# EAGLE design drv_ps (EAGLE 7.2.0)
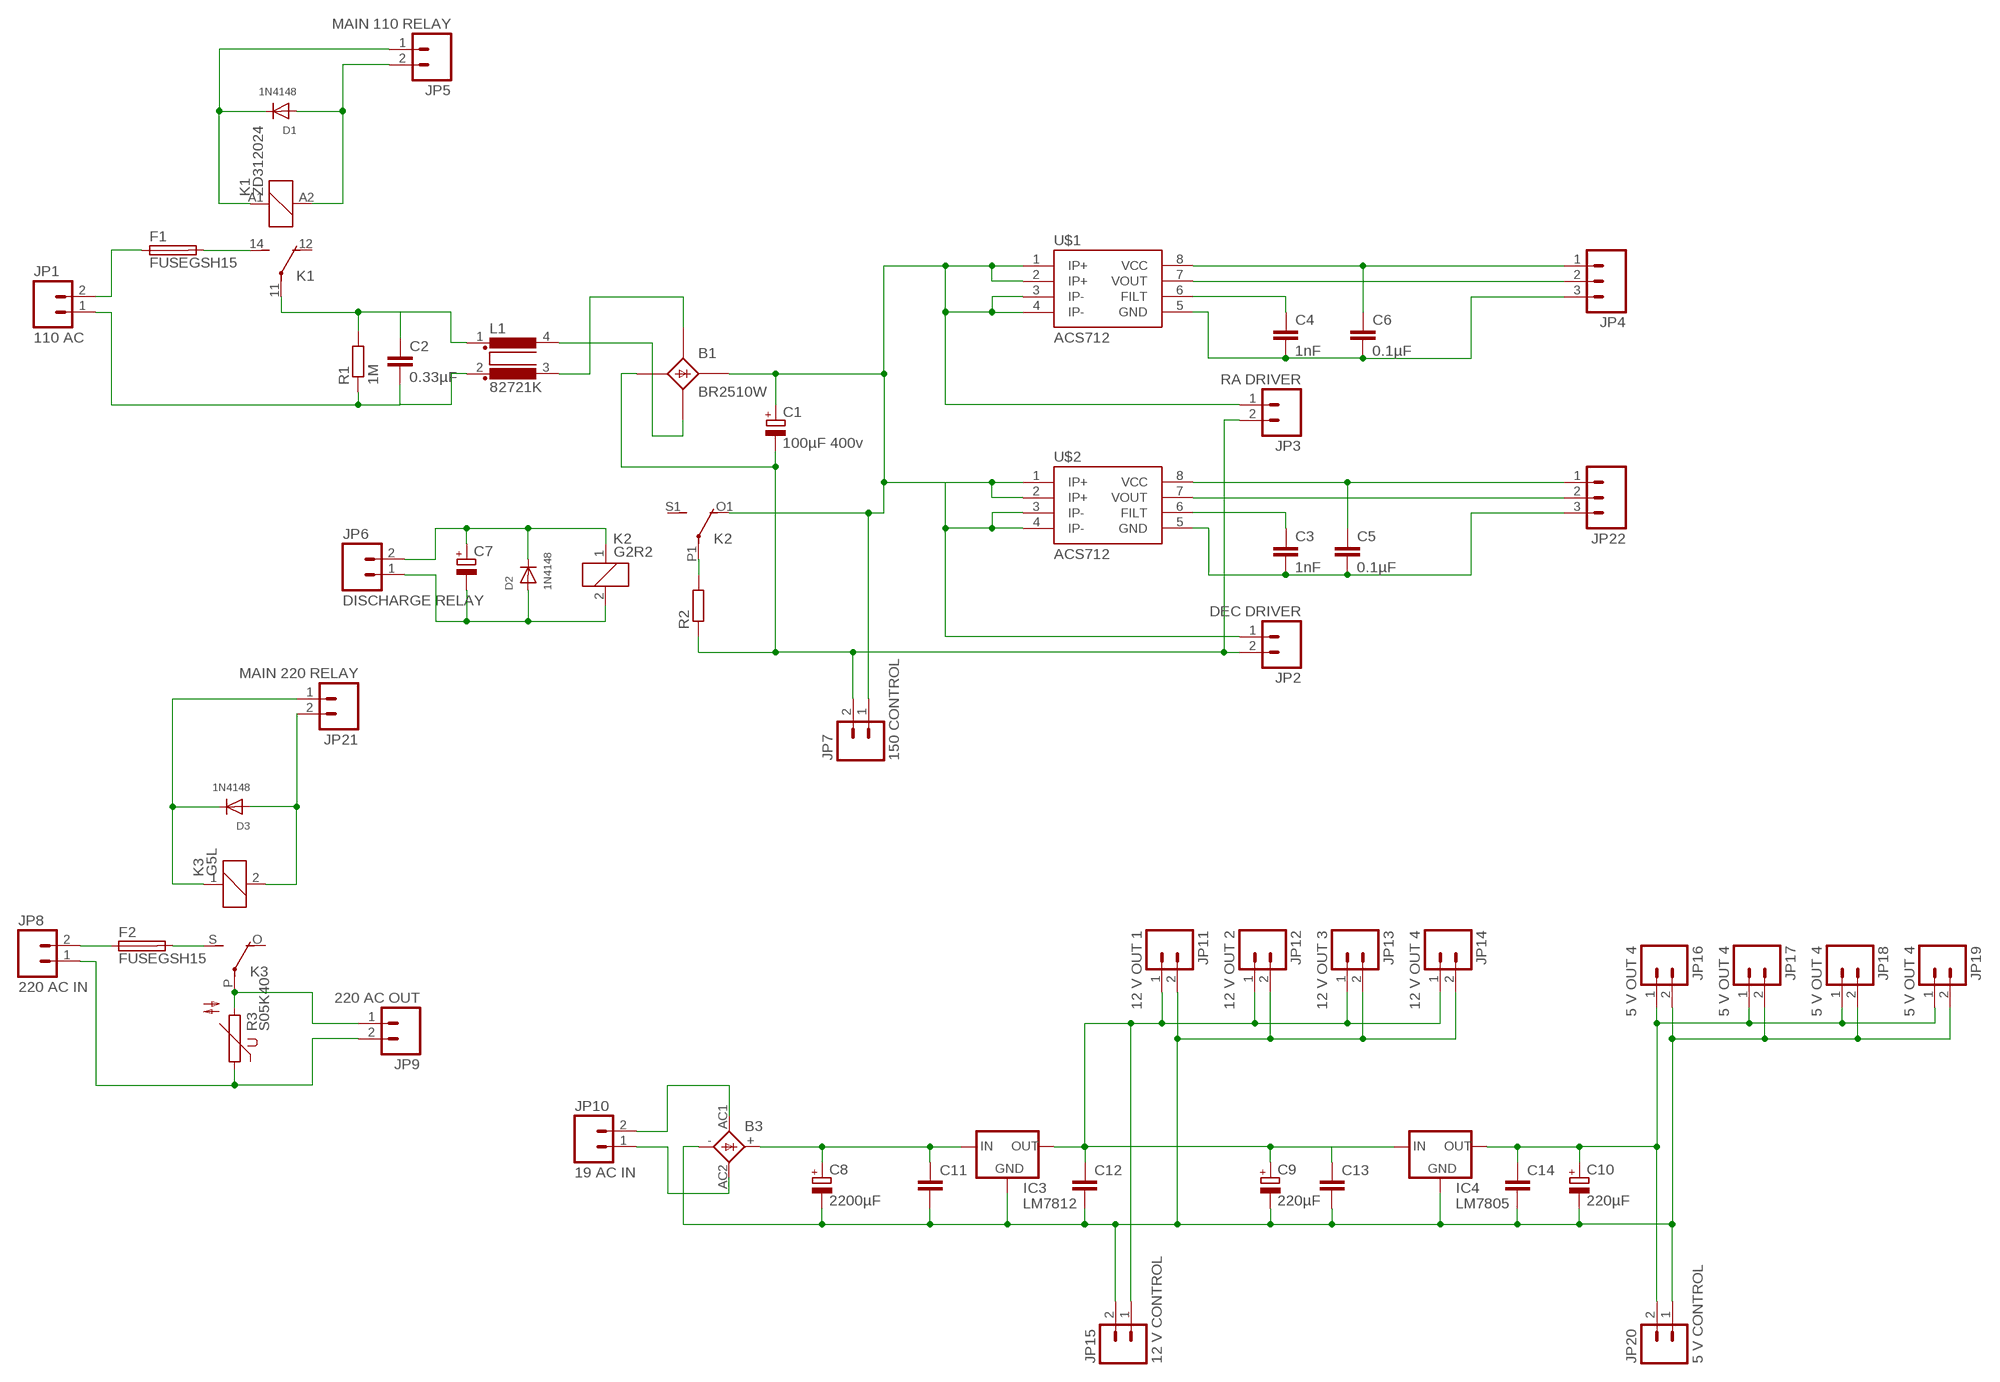
[diagram p0: schematic, sheet 1]

## Parts
B1  BR2510W  B25A-  [B25A-]
B3  GBPC1  [GBPC1]
C1  100µF 400v  CPOL-EUE10-35  [EB35D]
C2  0.33µF  C-EU150-054X183  [C150-054X183]
C3  1nF  C-EUC0805  [C0805]
C4  1nF  C-EUC0805  [C0805]
C5  0.1µF  C-EUC0805  [C0805]
C6  0.1µF  C-EUC0805  [C0805]
C7  CPOL-EUE2,5-6E  [E2,5-6E]
C8  2200µF  CPOL-EUE5-13  [E5-13]
C9  220µF  CPOL-EUE2.5-5  [E2,5-5]
C10  220µF  CPOL-EUE2.5-5  [E2,5-5]
C11  C-EUC0805  [C0805]
C12  C-EUC0805  [C0805]
C13  C-EUC0805  [C0805]
C14  C-EUC0805  [C0805]
D1  1N4148  DIODEDO-1N4148  [DO-1N4148]
D2  1N4148  DIODEDO-1N4148  [DO-1N4148]
D3  1N4148  DIODEDO-1N4148  [DO-1N4148]
F1  FUSEGSH15  [GSH15]
F2  FUSEGSH15  [GSH15]
IC3  LM7812  V_REG_78XXSIDE  [78XXL]
IC4  LM7805  V_REG_78XXSIDE  [78XXL]
JP1  110 AC  M025MM  [SCREWTERMINAL-5MM-2]
JP2  DEC DRIVER  M025MM  [SCREWTERMINAL-5MM-2]
JP3  RA DRIVER  M025MM  [SCREWTERMINAL-5MM-2]
JP4  M03POLAR  [MOLEX-1X3]
JP5  MAIN 110 RELAY  M02POLAR  [MOLEX-1X2]
JP6  DISCHARGE RELAY  M02POLAR  [MOLEX-1X2]
JP7  150 CONTROL  M02POLAR  [MOLEX-1X2]
JP8  220 AC IN  M025MM  [SCREWTERMINAL-5MM-2]
JP9  220 AC OUT  M025MM  [SCREWTERMINAL-5MM-2]
JP10  19 AC IN  M025MM  [SCREWTERMINAL-5MM-2]
JP11  12 V OUT 1  M02JST-PTH-VERT  [JST-2-PTH-VERT]
JP12  12 V OUT 2  M02JST-PTH-VERT  [JST-2-PTH-VERT]
JP13  12 V OUT 3  M02JST-PTH-VERT  [JST-2-PTH-VERT]
JP14  12 V OUT 4  M02JST-PTH-VERT  [JST-2-PTH-VERT]
JP15  12 V CONTROL  M02PTH  [1X02]
JP16  5 V OUT 4  M02JST-PTH-VERT  [JST-2-PTH-VERT]
JP17  5 V OUT 4  M02JST-PTH-VERT  [JST-2-PTH-VERT]
JP18  5 V OUT 4  M02JST-PTH-VERT  [JST-2-PTH-VERT]
JP19  5 V OUT 4  M02JST-PTH-VERT  [JST-2-PTH-VERT]
JP20  5 V CONTROL  M02PTH  [1X02]
JP21  MAIN 220 RELAY  M02POLAR  [MOLEX-1X2]
JP22  M03POLAR  [MOLEX-1X3]
K1  ZD312024  [ZD1]
K2  G2R2  [G2R2]
K3  G5L  [G5LE]
L1  82721K  [82721K]
R1  1M  R-EU_0411/15  [0411/15]
R2  R-EU_VTA54  [VTA54]
R3  S05K40  [S05K40]
U$1  ACS712  [SO08]
U$2  ACS712  [SO08]

## Nets
5VCC: C10.+ C14.1 IC4.OUT JP16.1 JP17.1 JP18.1 JP19.1 JP20.2
12VCC: C9.+ C12.1 C13.1 IC3.OUT IC4.IN JP11.1 JP12.1 JP13.1 JP14.1 JP15.1
19AC1: B3.AC2 JP10.1
19AC2: B3.AC1 JP10.2
110AC2: B1.AC2-(AC2) L1.4
110ACAF: F1.2 K1.14(2:S)
110ACAR: C2.1 K1.11(2:P) L1.1 R1.2
110ACF1: B1.AC1-(AC1) L1.3
110ACG1: C2.2 JP1.1 L1.2 R1.1
110ACPF: F1.1 JP1.2
110VC: B1.+1(+) C1.+ JP2.1 JP3.1 JP7.1 K2.O1(2:O) U$1.1(IP+) U$1.2(IP+) U$1.3(IP-) U$1.4(IP-) U$2.1(IP+) U$2.2(IP+) U$2.3(IP-) U$2.4(IP-)
AGND: B1.-1(-) C1.- JP2.2 JP3.2 JP7.2 R2.1
GND: B3.- C8.- C9.- C10.- C11.2 C12.2 C13.2 C14.2 IC3.GND IC4.GND JP11.2 JP12.2 JP13.2 JP14.2 JP15.2 JP16.2 JP17.2 JP18.2 JP19.2 JP20.1
N$1: C4.1 U$1.6(FILT)
N$2: C4.2 C6.2 JP4.3 U$1.5(GND)
N$3: C3.1 U$2.6(FILT)
N$4: C6.1 JP4.1 U$1.8(VCC)
N$5: C3.2 C5.2 JP22.3 U$2.5(GND)
N$11: D1.C JP5.1 K1.A1
N$12: D1.A JP5.2 K1.A2
N$13: JP22.2 U$2.7(VOUT)
N$14: JP4.2 U$1.7(VOUT)
N$15: B3.+ C8.+ C11.1 IC3.IN
N$16: C5.1 JP22.1 U$2.8(VCC)
N$17: K2.P1(2:P) R2.2
N$18: C7.+ D2.C JP6.2 K2.1
N$19: C7.- D2.A JP6.1 K2.2
N$20: JP9.1 K3.P(2:P) R3.2
N$21: F2.1 JP8.2
N$22: F2.2 K3.S(2:S)
N$24: JP8.1 JP9.2 R3.1
N$37: D3.A JP21.2 K3.2
N$38: D3.C JP21.1 K3.1
Unconnected: B1.+ B1.- B1.AC1 B1.AC2 K1.12(2:O) K2.O2(3:O) K2.P2(3:P) K2.S1(2:S) K2.S2(3:S) K3.O(2:O)

## Library data of the parts
B1 = rectifier:B25A-: RECTIFIER 25-A bridge
B3 = rectifier:GBPC1: GENERAL INSTRUMENT RECTIFIER
C1 C8-C10 = rcl:CPOL-EU: POLARIZED CAPACITOR, European symbol
C2-C6 C11-C14 = rcl:C-EU: CAPACITOR, European symbol
C7 = resistor:CPOL-EU: POLARIZED CAPACITOR, European symbol
D1-D3 = adafruit:DIODE: Diode SMADIODE - SMA Surface Mount Package 20V 1A Schottky Diode Digikey: 641-1014-6-ND DO-1N4148 - Through Hole Small Current Diode SOD-123 20V 1 A (.5mV Vf) Schottky Diode - Digikey: MBRX120TPMSCT-ND SOD-323 10V 570mA (.38mV Vf, 3ns) Schottky Diode - Digikey: ZLLS410CT-ND SOD-523 30V 30mA Schottky Diode (RB751S-40TE61) - Digikey: RB751S-40TE61CT-ND SOT23-R/W - SOT23 Package (R = Solder Paste/Reflow Ovens, W = Hand-Soldering) BAT54Film 40V 300mA - Digikey: 497-7162-1-ND
F1 F2 = fuse:FUSE: Fuse; OC_FARNELL: unknown; OC_NEWARK: unknown
IC3 IC4 = SparkFun-PowerIC:V_REG_78XX: Voltage Regulator Standard 7805 5V regulator. IGO (Input Ground Output). Spark Fun Electronics SKU : COM-00107
JP1-JP3 JP5-JP21 = SparkFun-Connectors:M02: Standard 2-pin 0.1" header. Use with - straight break away headers ( PRT-00116) - right angle break away headers (PRT-00553) - swiss pins (PRT-00743) - machine pins (PRT-00117) - female headers (PRT-00115) Molex polarized connector foot print use with: PRT-08233 with associated crimp pins and housings. 2.54_SCREWTERM for use with PRT-10571. 3.5mm Screw Terminal footprints for PRT-08084 5mm Screw Terminal footprints for use with PRT-08433
JP4 JP22 = SparkFun-Connectors:M03: Header 3 Standard 3-pin 0.1" header. Use with straight break away headers (SKU : PRT-00116), right angle break away headers (PRT-00553), swiss pins (PRT-00743), machine pins (PRT-00117), and female headers (PRT-00115). Molex polarized connector foot print use with SKU : PRT-08232 with associated crimp pins and housings.
K1 = relay:ZD?1*: Power Relay SCHRACK 1 pole 30 A Source: http://www.schrack.com/.. 5848.pdf; OC_FARNELL: unknown; OC_NEWARK: unknown
K2 = relay:G2R2: RELAY 2 x switch, Omron; MF: OMRON COMPONENTS USA; MPN: G2R-2-DC6; OC_FARNELL: unknown; OC_NEWARK: 89C5317
K3 = relay:G5L: RELAY 1 x switch, 10 A/120 V AC, 8 A/30 V ADC, Omron; OC_FARNELL: unknown; OC_NEWARK: unknown
L1 = inductors:82721K: FILTER
R1 R2 = rcl:R-EU_: RESISTOR, European symbol
R3 = varistor:S05K40: VARISTOR
U$1 U$2 = SparkFun-AnalogIC:ACS712: Hall-effect-based isolated linear current sensor

## Board
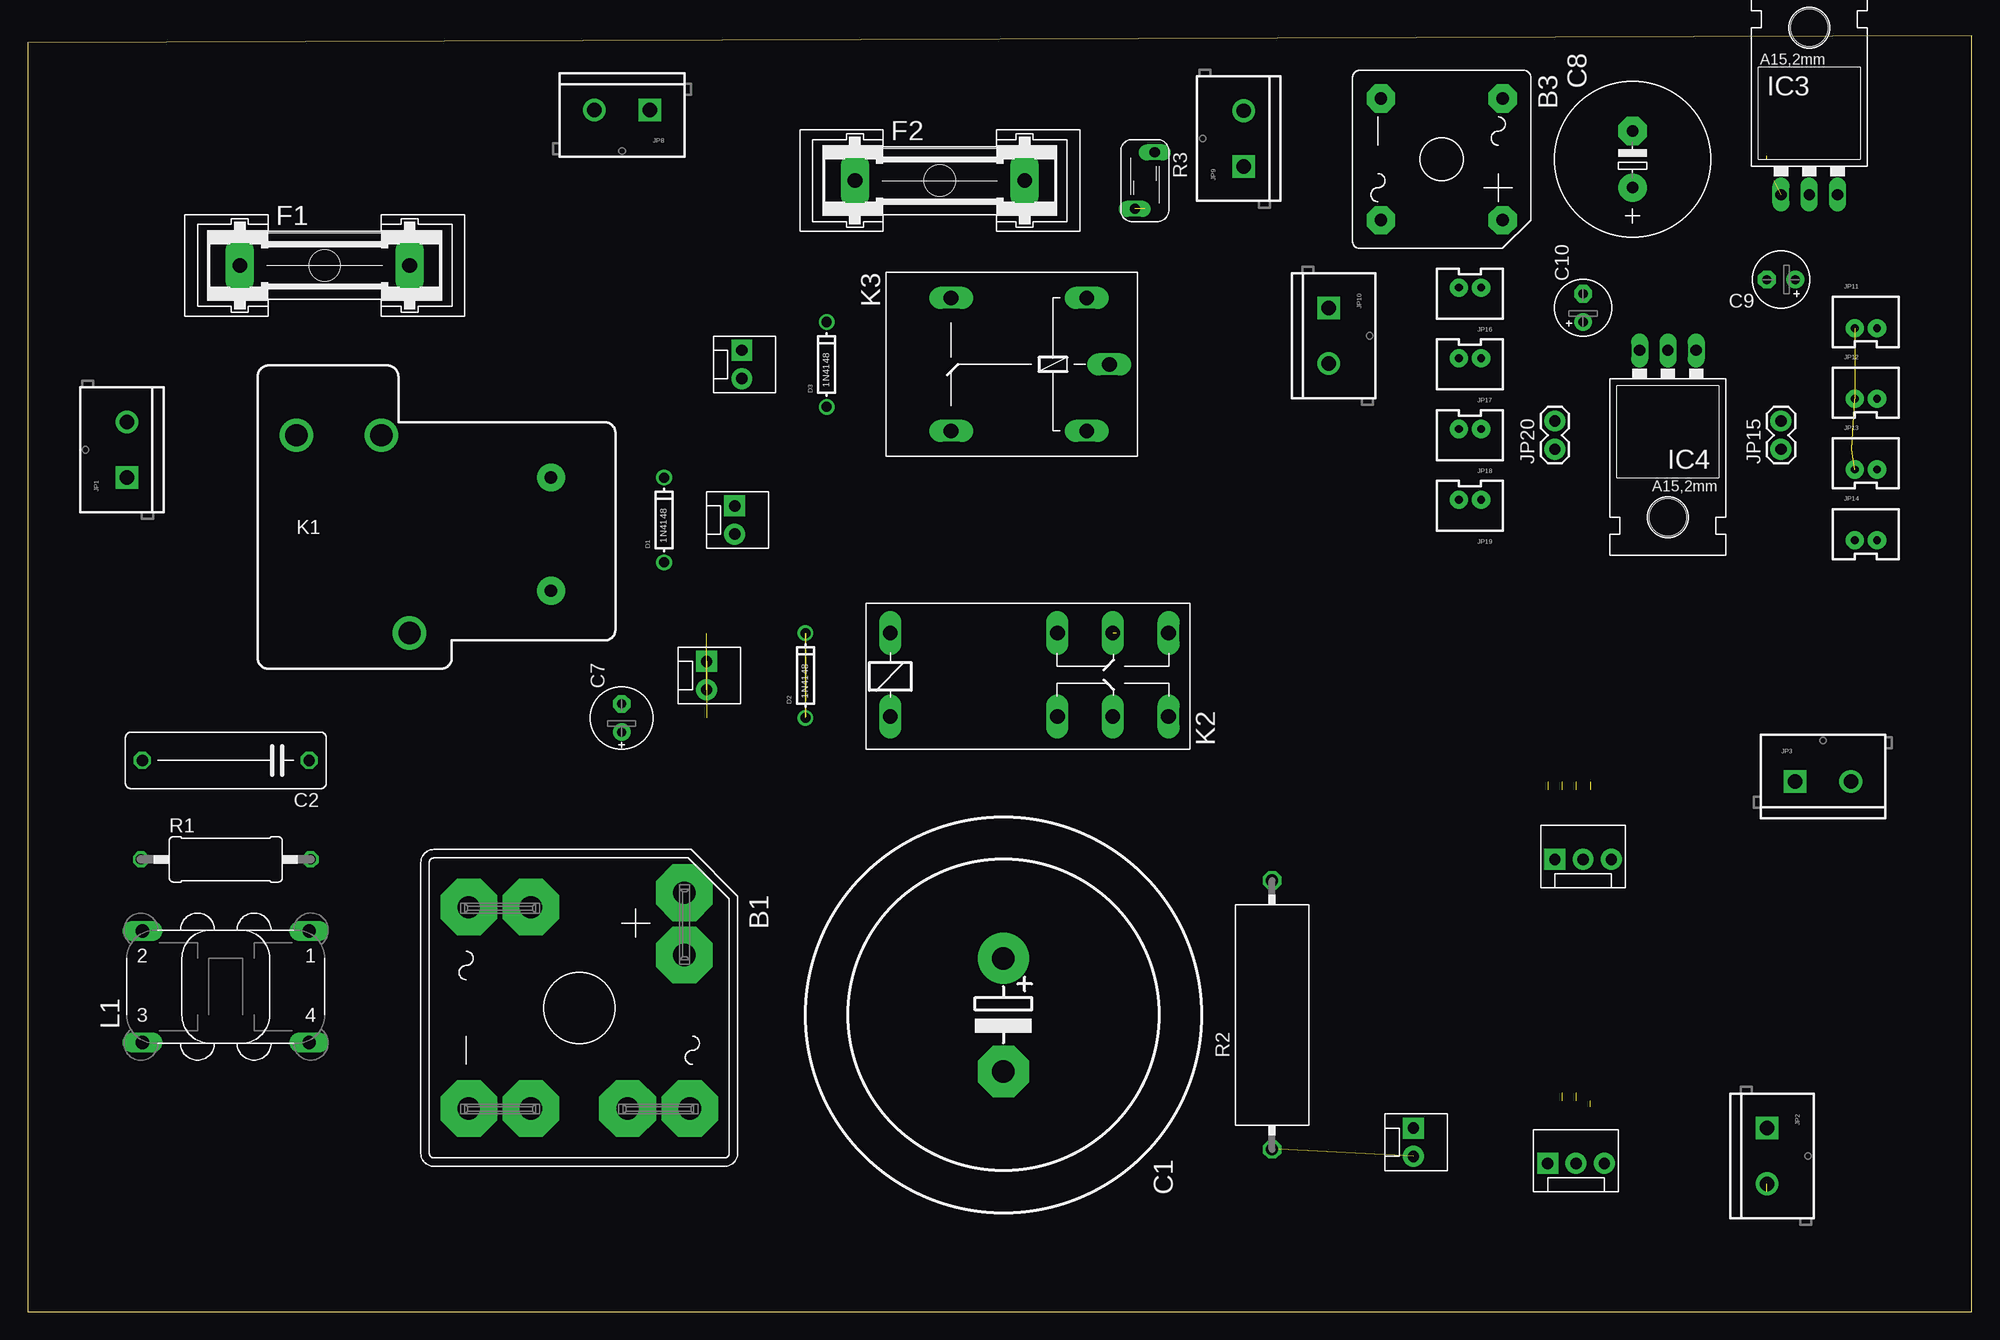
[diagram p1: board, top side]
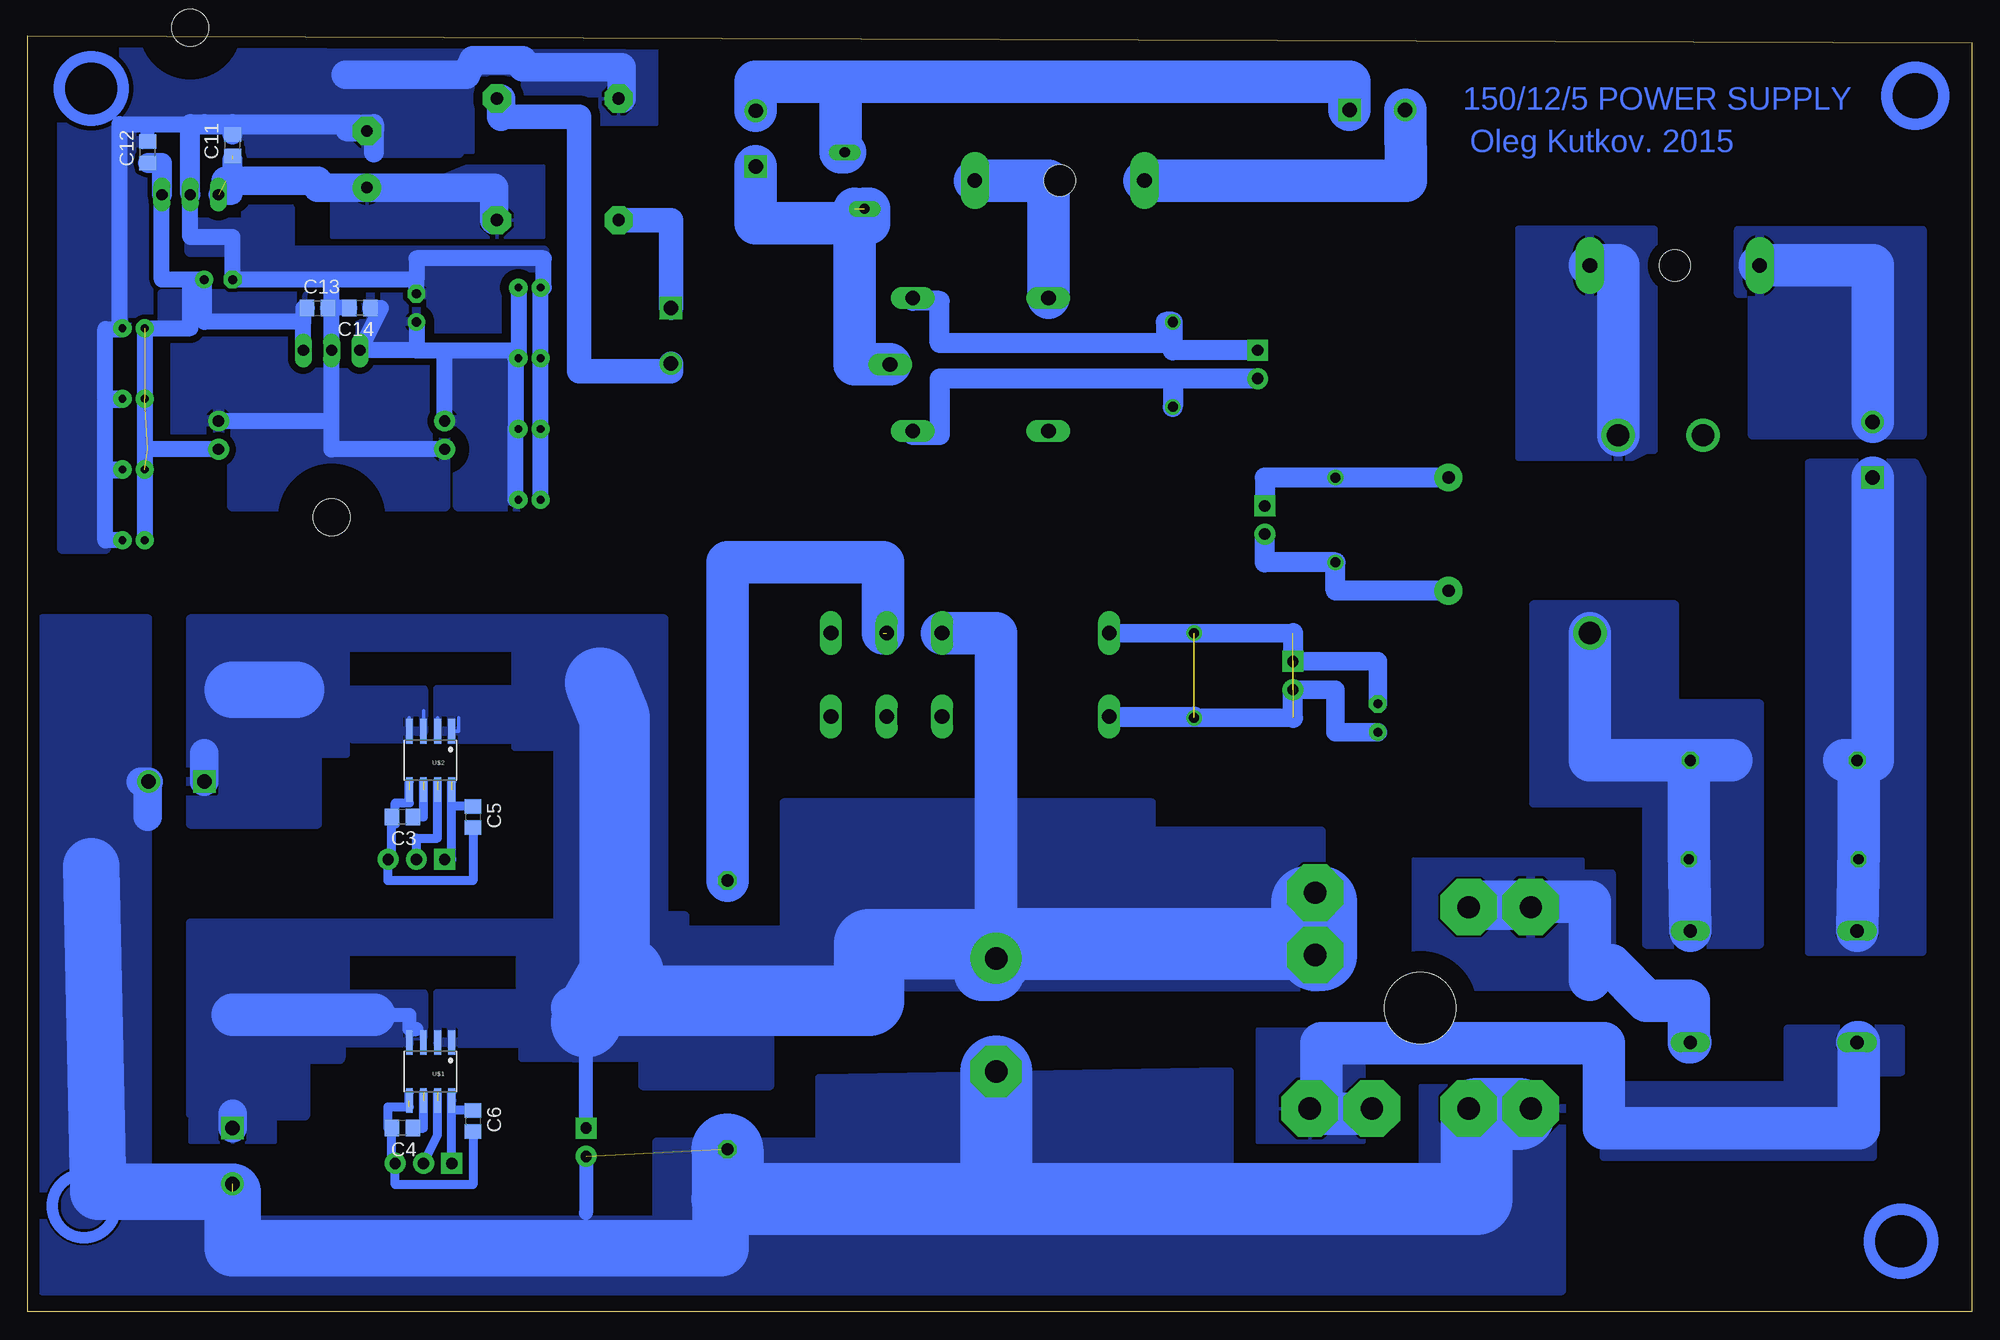
[diagram p2: board, bottom side, seen from below]

Size 174.6 x 114.61 mm. Coordinates in mm from the lower left corner, seen from the top.
Outline: 0,0 174.6,0 174.6,114.61 0,113.97 0,0
Copper layers (1*16): Top 0.035mm / dielectric 1.5mm / Bottom 0.035mm
Design rules "default": minimum track width 10mil, minimum drill 24mil, track to track 8mil, track to pad 8mil, pad to pad 8mil, via to via 8mil, smd to smd 8mil, copper to edge 40mil, drill to drill 8mil, minimum pad ring 10mil, minimum via ring 8mil, stop-mask expansion 4mil, vias tented up to drill 0mil, thermal gap 10mil

### Footprints (pad centres in the part's own frame; a part is rotated, then mirrored left to right if it is on the bottom)
B25A- = drill 2.007 pad 5.08 octagon: + -10.338,9.449; +1 -4.75,9.449; - 9.042,-4.343; -1 9.042,-9.931; AC1 9.042,4.343; AC1- 9.042,9.931; AC2 -9.042,-4.343; AC2- -9.042,-9.931 | hole 6.401: 0,0
GBPC1 = drill 1.118 pad 2.54 octagon: + 5.461,5.461; - -5.461,-5.461; AC1 -5.461,5.461; AC2 5.461,-5.461
EB35D = drill 2.007 pad 4.597: + -5.08,0 | drill 2.007 pad 4.597 octagon: - 5.08,0
C150-054X183 = drill 1.016 octagon: 1 -7.493,0; 2 7.493,0
C0805 = smd 1.3 x 1.5: 1 -0.95,0; 2 0.95,0
E2,5-6E = drill 0.813 pad 1.575: + -1.27,0 | drill 0.813 pad 1.575 octagon: - 1.27,0
E5-13 = drill 1.016 pad 2.54: + -2.54,0 | drill 1.016 pad 2.54 octagon: - 2.54,0
E2,5-5 = drill 0.813 pad 1.6: + -1.27,0 | drill 0.813 pad 1.6 octagon: - 1.27,0
DO-1N4148 = drill 0.9: A -3.81,0; C 3.81,0
GSH15 = drill 1.321 pad 2.54 long: 1 -7.62,0; 2 7.62,0 | hole 2.794: 0,0
78XXL = drill 1.016 long: GND 0,-3.81; IN -2.54,-3.81; OUT 2.54,-3.81 | hole 3.302: 0,11.176
SCREWTERMINAL-5MM-2 = drill 1.3 pad 2.032 square: 1 0,0 | drill 1.3 pad 2.032: 2 5,0
MOLEX-1X3 = drill 1.016 pad 1.88 square: 1 0,0 | drill 1.016 pad 1.88: 2 2.54,0; 3 5.08,0
MOLEX-1X2 = drill 1.016 pad 1.88 square: 1 0,0 | drill 1.016 pad 1.88: 2 2.54,0
JST-2-PTH-VERT = drill 0.7 pad 1.626: 1 -1,-0.55; 2 1,-0.55
1X02 = drill 1.016 pad 1.88: 1 0,0; 2 2.54,0
ZD1 = drill 2 pad 2.5: 11 -2.54,-8.88; 12 -12.7,8.88; 14 -5.08,8.88 | drill 1.1 pad 2.5: A1 10.16,5.08; A2 10.16,-5.08
G2R2 = drill 1.321 long: 1 -2.54,-3.683; 2 -2.54,3.81; O1 12.471,3.81; O2 12.471,-3.683; P1 17.45,3.81; P2 17.45,-3.683; S1 22.454,3.81; S2 22.454,-3.683
G5LE = drill 1.321 long: 1 -7.493,-5.969; 2 -7.493,5.969; O 4.699,5.969; P -9.525,0; S 4.699,-5.969
82721K = drill 1.194 long: 1 7.493,5.004; 2 -7.493,5.004; 3 -7.493,-5.004; 4 7.493,-5.004
0411/15 = drill 0.914 octagon: 1 -7.62,0; 2 7.62,0
VTA54 = drill 1.1 octagon: 1 -12.065,0; 2 12.065,0
S05K40 = drill 0.914 long: 1 -0.889,-2.54; 2 0.889,2.54
SO08 = smd 0.61 x 2.21: 1 -1.905,-2.616; 2 -0.635,-2.616; 3 0.635,-2.616; 4 1.905,-2.616; 5 1.905,2.616; 6 0.635,2.616; 7 -0.635,2.616; 8 -1.905,2.616

### Placement (x,y rotation side)
B1  49.53,27.3 270 top
B3  127,103.5 270 top
C1  87.63,26.67 270 top
C2  17.78,49.53 180 top
C3  140.97,44.45 180 bottom
C4  140.97,16.51 180 bottom
C5  134.62,44.45 270 bottom
C6  134.62,17.14 270 bottom
C7  53.34,53.34 90 top
C8  144.15,103.5 90 top
C9  157.48,92.71 180 top
C10  139.7,90.17 90 top
C11  156.21,104.77 90 bottom
C12  163.83,104.14 90 bottom
C13  148.59,90.17 0 bottom
C14  144.78,90.17 180 bottom
D1  57.15,71.12 90 top
D2  69.85,57.15 90 top
D3  71.75,85.09 90 top
F1  26.67,93.98 0 top
F2  81.92,101.6 0 top
IC3  160.02,104.14 0 top
IC4  147.32,82.55 180 top
JP1  8.89,74.93 90 top
JP2  156.21,16.51 270 top
JP3  158.75,47.62 0 top
JP4  136.53,13.34 0 top
JP5  63.5,72.39 270 top
JP6  60.96,58.42 270 top
JP7  124.46,16.51 270 top
JP8  55.88,107.95 180 top
JP9  109.22,102.87 90 top
JP10  116.84,90.17 270 top
JP11  165.1,88.9 0 top
JP12  165.1,82.55 0 top
JP13  165.1,76.2 0 top
JP14  165.1,69.85 0 top
JP15  157.48,77.47 90 top
JP16  129.54,91.44 180 top
JP17  129.54,85.09 180 top
JP18  129.54,78.74 180 top
JP19  129.54,72.39 180 top
JP20  137.16,77.47 90 top
JP21  64.14,86.36 270 top
JP22  137.16,40.64 0 top
K1  36.83,69.85 0 top
K2  80.01,57.15 0 top
K3  87.63,85.09 180 top
L1  17.78,29.21 0 top
R1  17.78,40.64 0 top
R2  111.76,26.67 90 top
R3  100.33,101.6 180 top
U$1  138.43,21.59 180 bottom
U$2  138.43,49.53 180 bottom

### Tracks (layer width: path | path; a pad name or v marks a point on that pad's centre or on a via)
5VCC
  Bottom 1.422: C10.+ 139.7,86.36 | 139.7,86.36 IC4.OUT 142.88,90.17 C14.1 | JP16.1 130.54,86.36 | 130.54,86.36 JP17.1 130.81,85.64 130.81,79.38 | 130.81,79.38 130.54,79.38 JP18.1 | JP19.1 130.81,72.94 130.81,79.38 | 139.7,86.36 137.16,86.36 | 137.16,86.36 130.54,86.36 | JP20.2 137.16,86.36
  pour Bottom (isolate 1.27): 130.81,91.44 130.81,86.36 137.16,86.36 137.16,80.01 135.89,80.01 135.89,72.39 129.54,72.39
  pour Bottom (isolate 0.406): 139.7,88.9 139.7,91.44 144.78,91.44 144.78,86.36 139.7,86.36 139.7,87.63
12VCC  (3 unrouted)
  Bottom 1.422: 160.02,92.71 C9.+ 158.75,88.9 149.86,88.9 | 160.02,92.71 162.56,92.71 IC3.OUT | JP14.1 JP11.1 160.02,88.35 160.02,92.71 | IC4.IN 149.86,88.9 | C13.1 149.86,90.17 149.86,88.9 | JP15.1 163.83,77.47
  Bottom 1.778: C12.1 162.56,103.19 IC3.OUT
  pour Bottom (isolate 0.305): 149.86,90.17 149.86,91.44 162.56,91.44 162.56,88.9 149.86,88.9
19AC1
  Bottom 2.184: B3.AC2 116.84,98.04 JP10.1
19AC2
  Bottom 2.184: 132.08,107.31 125.09,107.31 125.09,84.45 116.84,84.45 JP10.2
  Bottom 2.54: B3.AC1 132.08,108.97 132.08,107.31
110AC2
  Bottom 3.81: L1.4 25.4,24.21 25.4,27.94 29.21,27.94 32.38,31.12 | B1.AC2- 39.6,36.2 45.09,36.2 45.09,36.83 34.29,36.83 34.29,29.84
  pour Bottom: 35.56,29.21 48.26,29.21 48.26,39.37 32.38,39.37 32.38,29.21 34.29,29.21
  pour Bottom: 44.45,29.21 50.16,29.21 50.16,40.64 34.92,40.64 34.92,29.21 42.55,29.21
110ACAF
  Bottom 3.81: F1.2 31.75,93.98 K1.14
  pour Bottom: 29.21,77.47 28.57,77.47 28.57,97.16 40.64,97.16 40.64,88.9 40.64,76.83 30.48,76.83
110ACAR
  Bottom 3.81: 21.59,49.53 C2.1 25.4,49.53 | 25.4,49.53 34.29,49.53 K1.11 | L1.1 25.4,41.83 | 25.4,41.83 25.4,49.53 | R1.2 25.4,41.83
  pour Bottom: 19.05,33.02 19.05,54.61 26.67,54.61 26.67,63.5 39.37,63.5 39.37,45.72 29.21,45.72 29.21,33.02 20.32,33.02
110ACF1
  Bottom 3.81: L1.3 10.16,24.21 10.16,16.51 33.02,16.51 33.02,24.13 58.42,24.13 58.42,17.78 | 58.42,17.78 54.61,17.78 | 58.42,17.78 59.46,17.78 B1.AC1-
  pour Bottom: 6.35,25.4 16.51,25.4 16.51,20.32 33.02,20.32 33.02,13.97 8.89,13.97 8.89,21.59 6.35,21.59
  pour Bottom: 54.61,16.51 54.61,15.24 64.14,15.24 64.14,25.4 54.61,25.4 54.61,18.41
110ACG1
  Bottom 3.81: JP1.1 8.89,49.53 10.16,49.53 | 11.43,49.53 C2.2 10.16,49.53 | L1.2 10.16,41.83 | 10.16,41.83 10.16,49.53 | R1.1 10.16,41.83
  pour Bottom: 5.08,76.2 14.61,76.2 14.61,32.38 4.45,32.38 4.45,74.93
110ACPF
  Bottom 3.81: JP1.2 8.89,93.98 F1.1
  pour Bottom: 10.16,78.74 19.68,78.74 19.68,91.44 20.95,91.44 20.95,97.16 4.45,97.16 4.45,78.74 8.89,78.74
110VC
  Bottom 0.305: U$2.1 135.89,52.15 135.89,53.34 | U$2.2 137.79,53.34 | U$2.3 139.06,53.98 | U$2.4 140.34,53.34
  Bottom 1.27: JP7.1 124.46,26.03 | 143.51,26.67 140.34,26.67 140.34,25.4 139.7,25.4
  Bottom 1.778: 87.63,30.48 C1.+
  Bottom 2.54: JP3.1 158.75,50.16 | JP2.1 156.21,17.78
  Bottom 3.81: K2.O1 87.63,60.96 C1.+ | 125.73,26.03 121.28,27.94 125.73,27.3 | 156.21,26.67 143.51,26.67
  Bottom 5.08: 156.21,55.88 150.5,55.88 | 87.63,30.48 88.9,30.48 88.9,33.02
  Bottom 6.35: 88.9,33.02 99.06,33.02 99.06,27.94 121.28,27.94 121.92,27.94 121.92,30.48 | 121.92,30.48 121.92,53.34 123.19,56.52 | 120.65,30.48 121.92,30.48 | 121.92,30.48 124.46,26.03
  Bottom 6.452: B1.+1 58.42,32.05 58.42,36.83 59.69,36.83 59.69,33.02 87.63,33.02 C1.+
  pour Bottom: 86.36,45.72 87.63,45.72 87.63,36.83 87.63,35.56
  pour Bottom: 58.42,38.1 58.42,43.18 72.39,43.18 73.66,43.18 73.66,45.72 87.63,45.72 87.63,29.21 58.42,29.21 58.42,35.56
  pour Bottom: 87.63,45.72 106.68,45.72 106.68,34.29 115.57,34.29 115.57,35.56 119.38,35.56 119.38,29.21 87.63,29.21
  pour Bottom: 117.47,34.29 117.47,62.23 130.81,62.23 130.81,50.8 127,50.8 127,26.67 130.18,26.67 130.18,22.86 119.38,22.86 119.38,20.32 107.95,20.32 107.95,34.29
  pour Bottom: 130.81,62.23 160.02,62.23 160.02,43.81 148.59,43.81 148.59,50.16 146.05,50.16 146.05,59.69 130.81,59.69
  pour Bottom (isolate 0.305): 130.81,55.88 137.79,55.88 137.79,51.43 130.81,51.43
  pour Bottom: 146.05,52.07 147.96,52.07 147.96,55.88 139.06,55.88 139.06,52.07 140.34,52.07 140.34,51.43 145.41,51.43
  pour Bottom (isolate 0.305): 123.83,28.58 137.79,28.58 137.79,24.13 123.83,24.13
  pour Bottom: 147.32,24.77 149.22,24.77 149.22,28.58 139.06,28.58 139.06,24.77 140.34,24.77 140.34,24.13 147.32,24.13
  pour Bottom: 146.69,29.84 146.69,22.86 149.86,22.86 149.86,17.78 158.75,17.78 158.75,29.84
  pour Bottom: 130.18,34.29 130.18,24.77 125.09,22.86 125.09,33.66
  pour Bottom: 126.36,34.92 160.02,34.92 160.02,17.78 149.86,19.05 149.86,22.86 146.05,24.77 146.05,32.38 126.36,32.38
  pour Bottom (isolate 0.61): 152.4,17.78 152.4,15.24 160.02,15.24 160.02,17.78 153.67,17.78
AGND  (2 unrouted)
  Bottom 1.27: JP7.2 124.46,8.89
  Bottom 1.778: 111.76,15.24 R2.1
  Bottom 2.54: JP3.2 163.83,47.62 | 164.47,47.62 163.83,47.62 | 163.83,47.62 163.83,44.45
  Bottom 5.08: 168.91,40 168.28,10.79 156.21,10.79 156.21,5.71 112.39,5.71 112.39,14.61
  Bottom 6.452: C1.- 87.63,10.16 | 87.63,10.16 44.45,10.16 44.45,17.78 40.64,17.78 | R2.1 111.76,10.16 87.63,10.16
  pour Bottom: 163.83,8.25 163.83,62.23 173.35,62.23 173.35,1.91 36.83,1.91 36.83,19.05 46.99,19.05 46.99,12.7 66.67,12.7 66.67,21.59 103.5,20.95 103.5,15.24 118.11,15.24 118.11,8.25
  pour Bottom: 49.53,12.7 49.53,20.32 38.1,20.32 38.1,12.07 49.53,12.07
GND
  Bottom 1.27: C12.2 163.83,106.68 160.02,106.68
  Bottom 1.422: IC3.GND 160.02,96.52 156.21,96.52 C9.- 147.32,92.71 | JP14.2 167.64,69.3 167.64,75.56 166.1,75.56 JP13.2 167.64,75.65 167.64,81.91 166.1,81.91 JP12.2 167.64,82 167.64,88.27 166.1,88.27 JP11.2 166.37,88.35 166.37,106.68 158.75,106.68 | 147.32,90.17 IC4.GND 147.32,80.01 | C10.- 139.7,92.71 | 139.7,92.71 147.32,92.71 | 147.32,90.17 C13.2 C14.2 | 147.32,90.17 147.32,92.71 | JP15.2 147.32,80.01 | JP19.2 JP18.2 JP17.2 JP16.2 128.27,91.99 128.27,94.61 139.7,94.61 139.7,92.71 | JP20.1 147.32,77.47 147.32,80.01
  Bottom 1.778: 143.51,104.14 143.51,106.05 | 143.51,106.05 C8.- 146.05,106.05 | IC3.GND 160.02,106.68 158.75,106.68 156.21,106.68 | 156.21,106.68 143.51,106.68 143.51,106.05 | C11.2 156.21,106.68
  Bottom 2.54: B3.- 121.28,108.97 121.28,111.76 130.18,111.76 130.18,112.39 134.62,112.39 135.25,111.12 146.05,111.12
  pour Bottom (isolate 0.813): 128.27,93.98 128.27,95.25 151.13,95.25 151.13,99.06 154.94,99.06 154.94,97.79 160.02,97.79 160.02,95.25 156.21,95.25 156.21,92.71 139.7,92.71 139.7,91.44 138.43,91.44 138.43,87.63 132.08,87.63 132.08,92.71
  pour Bottom (isolate 0.61): 137.16,72.39 137.16,85.09 151.13,85.09 151.13,87.63 161.29,87.63 161.29,78.74 157.48,78.74 157.48,80.01 156.21,80.01 156.21,72.39
  pour Bottom (isolate 0.406): 135.89,113.03 171.45,113.03 171.45,68.58 167.64,68.58 167.64,88.9 163.83,88.9 163.83,106.68 154.94,106.68 154.94,104.14 135.89,104.14
  pour Bottom (isolate 0.813): 136.53,113.66 118.11,113.66 118.11,106.68 123.19,106.68 123.19,109.22 130.18,109.22 130.18,111.12 134.62,111.12 134.62,104.14 137.16,104.14 137.16,113.03
N$1  (1 unrouted)
  Bottom 0.813: C4.1 139.06,16.51 139.06,19.69
N$2  (1 unrouted)
  Bottom 0.813: 140.34,19.69 140.34,18.41 142.24,18.41 142.24,16.51 C4.2 141.92,13.97 JP4.3 141.6,11.43 134.62,11.43 C6.2
N$3  (1 unrouted)
  Bottom 0.813: C3.1 139.06,44.45 139.06,47.62
N$4
  Bottom 0.813: JP4.1 U$1.8 | U$1.8 136.53,19.69 | C6.1 136.53,18.09 U$1.8
N$5  (1 unrouted)
  Bottom 0.813: 140.34,47.62 140.34,45.72 141.6,45.72 141.6,43.81 C3.2 141.92,40.64 JP22.3 142.24,38.73 134.62,38.73 C5.2
N$11
  Bottom 1.778: K1.A1 D1.C 63.5,74.93 JP5.1
N$12
  Bottom 1.778: K1.A2 57.15,64.77 D1.A 63.5,67.31 JP5.2
N$13  (1 unrouted)
  Bottom 0.813: JP22.2 139.7,42.55 137.79,42.55 137.79,47.62
N$14  (1 unrouted)
  Bottom 0.813: JP4.2 137.79,15.88 137.79,19.69
N$15  (2 unrouted)
  Bottom 1.778: IC3.IN 156.21,100.33 156.21,103.5
  Bottom 2.54: B3.+ 132.72,98.04 132.72,100.97 C8.+ 148.59,100.97 148.59,101.6 156.84,101.6
  pour Bottom (isolate 0.813): 128.27,96.52 128.27,102.87 135.25,102.87 138.43,101.6 147.32,101.6 147.32,96.52
N$16  (1 unrouted)
  Bottom 0.813: C5.1 136.53,45.4 | 136.53,45.4 136.53,47.62 | JP22.1 136.53,40.64 136.53,45.4
N$17  (1 unrouted)
  Bottom 3.81: R2.2 111.76,67.31 97.79,67.31 97.79,60.96
N$18  (2 unrouted)
  Bottom 1.676: C7.+ 57.15,52.07 57.15,55.88 JP6.2 | D2.C 60.96,60.96
  Bottom 1.778: K2.1 69.85,53.47 | 60.96,53.34 JP6.2
N$19  (2 unrouted)
  Bottom 1.676: C7.- 53.34,58.42 JP6.1 | K2.2 69.85,60.96 | D2.A 60.96,53.34
  Bottom 1.778: 60.96,60.96 JP6.1
N$20  (1 unrouted)
  Bottom 3.81: R3.2 99.06,99.06 99.06,97.79 109.22,97.79 JP9.1 | K3.P 100.33,85.09 100.33,96.52 100.33,99.06
N$21
  Bottom 3.81: F2.1 50.8,101.6 JP8.2
N$22
  Bottom 3.81: F2.2 82.93,101.6 K3.S
N$24
  Bottom 3.81: JP8.1 55.88,110.49 101.6,110.49 | JP9.2 109.22,110.49 101.6,110.49 | R3.1 101.6,104.14 101.6,110.49
N$37
  Bottom 1.778: D3.A 71.75,83.82 JP21.2 92.71,83.82 92.71,78.74 95.12,78.74 K3.2
N$38
  Bottom 1.778: JP21.1 71.75,86.36 D3.C 72.39,88.9 72.39,87 92.71,87 92.71,90.8 95.12,90.8 K3.1
(copper drawn outside any net)
  shapes: Bottom circle x4

### Text on the board
Bottom: 150/12/5 POWER SUPPLY | Oleg Kutkov. 2015